# Altium schematic sheet ESP32-HWE.SchDoc
size A4; SheetNumber: 1; SheetTotal: 1
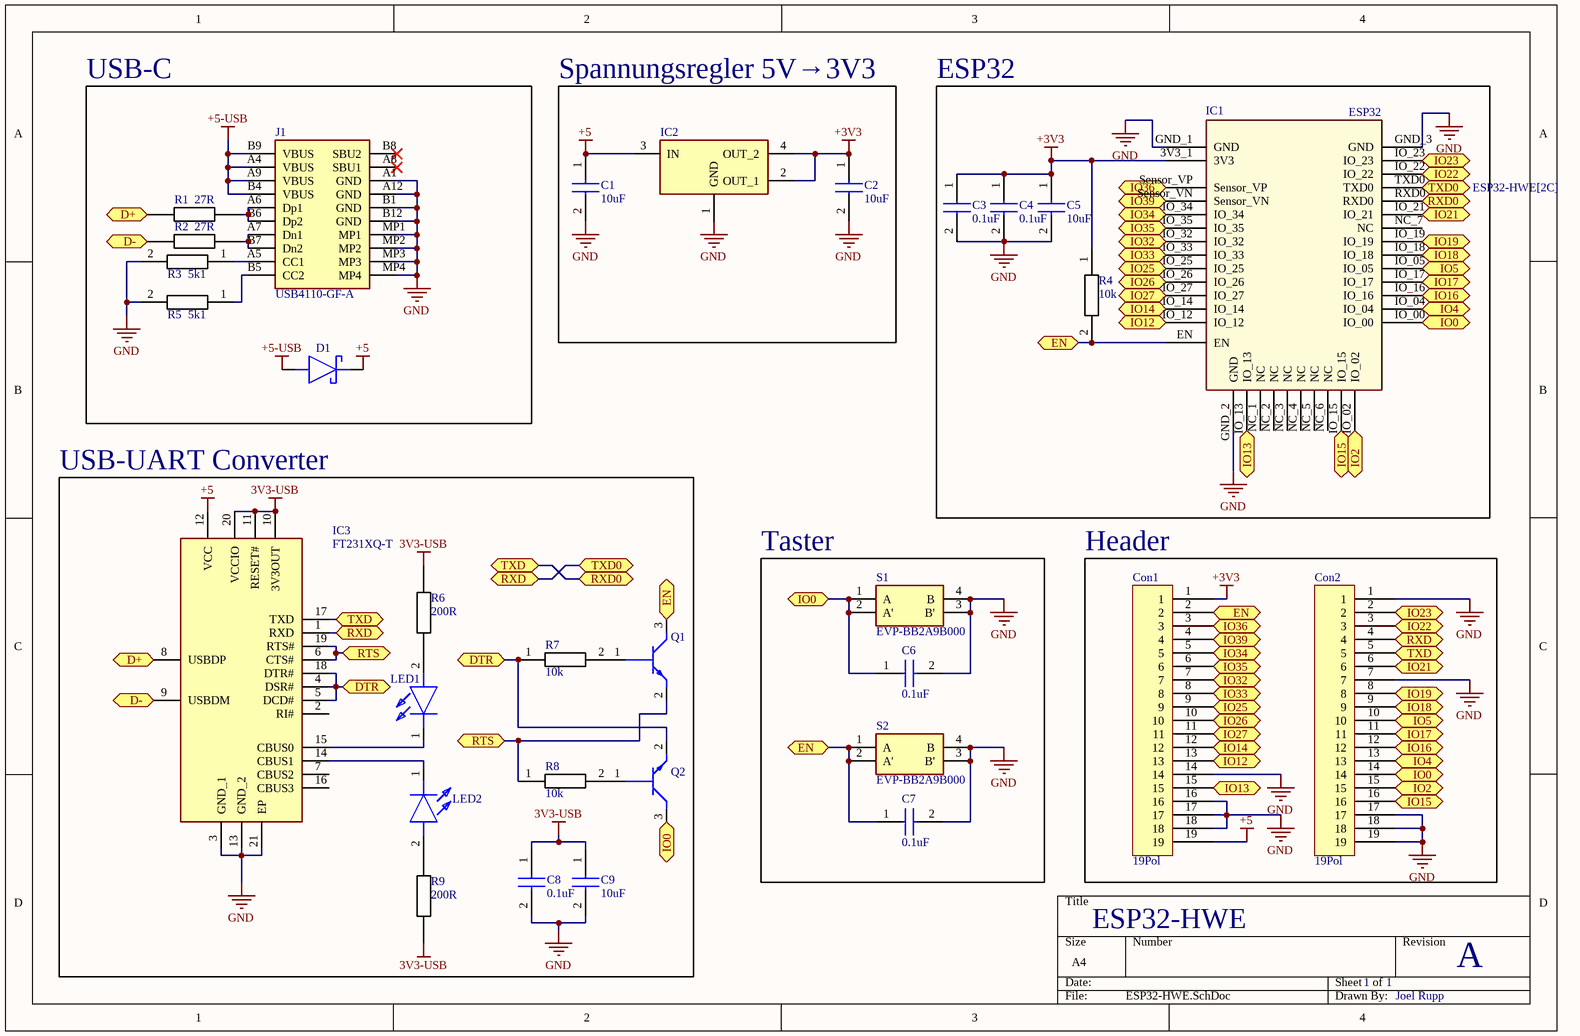
[diagram p0: ESP32-HWE.SchDoc]

## Parts
C1  10uF  [CAPC2012X140N]
C2  10uF  [CAPC2012X140N]
C3  0.1uF  [CAPC2012X94N]
C4  0.1uF  [CAPC2012X94N]
C5  10uF  [CAPC2012X140N]
C6  0.1uF  [CAPC2012X94N]
C7  0.1uF  [CAPC2012X94N]
C8  0.1uF  [CAPC2012X94N]
C9  10uF  [CAPC2012X140N]
Con1  19Pol  [Header_19-Double]  (no BOM)
Con2  19Pol  [Header_19-Double]  (no BOM)
D1  SS0540_R1_00001  [SOD3816X135N]  (value not drawn)
IC1  ESP32  [ESP-WRC]
IC2  AP7361C-33ER-13  [SOT230P700X180-4N]  (value not drawn)
IC3  FT231XQ-T  [QFN50P400X400X80-21N]
J1  USB4110-GF-A  [USB4110GFA]
LED1  150080YS75000  [LEDC2012X80N]  (value not drawn)
LED2  150080YS75000  [LEDC2012X80N]  (value not drawn)
Q1  PMBT3904,235  [SOT95P230X110-3N]  (value not drawn)
Q2  PMBT3904,235  [SOT95P230X110-3N]  (value not drawn)
R1  27R  [RESC2012X65N]
R2  27R  [RESC2012X65N]
R3  5k1  [RESC2012X60N]
R4  10k  [RESC2012X60N]
R5  5k1  [RESC2012X60N]
R6  200R  [RESC2012X50N]
R7  10k  [RESC2012X60N]
R8  10k  [RESC2012X60N]
R9  200R  [RESC2012X50N]
S1  EVP-BB2A9B000  [EVPBB2A9B000]
S2  EVP-BB2A9B000  [EVPBB2A9B000]

## Blocks framed on the sheet
USB-C: D1 J1 R1-R3 R5
Spannungsregler 5V→3V3: C1 C2 IC2
ESP32: C3-C5 IC1 R4
USB-UART Converter: C8 C9 IC3 LED1 LED2 Q1 Q2 R6-R9
Taster: C6 C7 S1 S2
Header: Con1 Con2

## Ports
D+ (bidir, see ESP32-HWE[1A]), D+ (bidir, see ESP32-HWE[1C]), D- (bidir, see ESP32-HWE[1A]), D- (bidir, see ESP32-HWE[1C]), DTR (bidir, see ESP32-HWE[1C]), DTR (bidir, see ESP32-HWE[2C]), EN (bidir, see ESP32-HWE[2C], ESP32-HWE[3B], ESP32-HWE[3C]), EN (bidir, see ESP32-HWE[2C], ESP32-HWE[3B], ESP32-HWE[4C]), EN (bidir, see ESP32-HWE[2C], ESP32-HWE[3C], ESP32-HWE[4C]), EN (bidir, see ESP32-HWE[3B], ESP32-HWE[3C], ESP32-HWE[4C]), IO0 (bidir, see ESP32-HWE[2D], ESP32-HWE[3C], ESP32-HWE[4B]), IO0 (bidir, see ESP32-HWE[2D], ESP32-HWE[3C], ESP32-HWE[4D]), IO0 (bidir, see ESP32-HWE[2D], ESP32-HWE[4B], ESP32-HWE[4D]), IO0 (bidir, see ESP32-HWE[3C], ESP32-HWE[4B], ESP32-HWE[4D]), IO2 (bidir, see ESP32-HWE[4B]), IO2 (bidir, see ESP32-HWE[4D]), IO4 (bidir, see ESP32-HWE[4B]), IO4 (bidir, see ESP32-HWE[4C]), IO5 (bidir, see ESP32-HWE[4B]), IO5 (bidir, see ESP32-HWE[4C]), IO12 (bidir, see ESP32-HWE[3B]), IO12 (bidir, see ESP32-HWE[4C]), IO13 (bidir, see ESP32-HWE[4B]), IO13 (bidir, see ESP32-HWE[4D]), IO14 (bidir, see ESP32-HWE[3B]), IO14 (bidir, see ESP32-HWE[4C]), IO15 (bidir, see ESP32-HWE[4B]), IO15 (bidir, see ESP32-HWE[4D]), IO16 (bidir, see ESP32-HWE[4B]), IO16 (bidir, see ESP32-HWE[4C]), IO17 (bidir, see ESP32-HWE[4B]), IO17 (bidir, see ESP32-HWE[4C]), IO18 (bidir, see ESP32-HWE[4A]), IO18 (bidir, see ESP32-HWE[4C]), IO19 (bidir, see ESP32-HWE[4A]), IO19 (bidir, see ESP32-HWE[4C]), IO21 (bidir, see ESP32-HWE[4A]), IO21 (bidir, see ESP32-HWE[4C]), IO22 (bidir, see ESP32-HWE[4A]), IO22 (bidir, see ESP32-HWE[4C]), IO23 (bidir, see ESP32-HWE[4A]), IO23 (bidir, see ESP32-HWE[4C]), IO25 (bidir, see ESP32-HWE[3B]), IO25 (bidir, see ESP32-HWE[4C]), IO26 (bidir, see ESP32-HWE[3B]), IO26 (bidir, see ESP32-HWE[4C]), IO27 (bidir, see ESP32-HWE[3B]), IO27 (bidir, see ESP32-HWE[4C]), IO32 (bidir, see ESP32-HWE[3A]), IO32 (bidir, see ESP32-HWE[4C]), IO33 (bidir, see ESP32-HWE[3A]), IO33 (bidir, see ESP32-HWE[4C]), IO34 (bidir, see ESP32-HWE[3A]), IO34 (bidir, see ESP32-HWE[4C]), IO35 (bidir, see ESP32-HWE[3A]), IO35 (bidir, see ESP32-HWE[4C]), IO36 (bidir, see ESP32-HWE[3A]), IO36 (bidir, see ESP32-HWE[4C]), IO39 (bidir, see ESP32-HWE[3A]), IO39 (bidir, see ESP32-HWE[4C]), RTS (bidir, see ESP32-HWE[1C]), RTS (bidir, see ESP32-HWE[2C]), RXD0 (bidir, see ESP32-HWE[2C]), RXD0 (bidir, see ESP32-HWE[4A]), RXD (bidir, see ESP32-HWE[1C], ESP32-HWE[2C]), RXD (bidir, see ESP32-HWE[1C], ESP32-HWE[4C]), RXD (bidir, see ESP32-HWE[2C], ESP32-HWE[4C]), TXD0 (bidir, see ESP32-HWE[2C]), TXD0 (bidir, see ESP32-HWE[4A]), TXD (bidir, see ESP32-HWE[1C], ESP32-HWE[2C]), TXD (bidir, see ESP32-HWE[1C], ESP32-HWE[4C]), TXD (bidir, see ESP32-HWE[2C], ESP32-HWE[4C])

## Nets
3V3-USB: C8.1 C9.1 IC3.10(3V3OUT) IC3.11(RESET#) IC3.20(VCCIO) R6.2 R9.1
+3V3: C2.1 C3.1 C4.1 C5.1 Con1.1 IC1.3V3_1(3V3) IC2.2(OUT_1) IC2.4(OUT_2) R4.1
+5: C1.1 Con1.19 D1.1(K) IC2.3(IN) IC3.12(VCC)
+5-USB: D1.2(A) J1.A4(VBUS) J1.A9(VBUS) J1.B4(VBUS) J1.B9(VBUS)
GND: C1.2 C2.2 C3.2 C4.2 C5.2 C6.2 C7.2 C8.2 C9.2 Con1.14 Con1.16 Con1.17 Con1.18 Con2.1 Con2.7 Con2.17 Con2.18 Con2.19 IC1.GND_1(GND) IC1.GND_2(GND) IC1.GND_3(GND) IC2.1(GND) IC3.3(GND_1) IC3.13(GND_2) IC3.21(EP) J1.A1(GND) J1.A12(GND) J1.B1(GND) J1.B12(GND) J1.MP1 J1.MP2 J1.MP3 J1.MP4 R3.2 R5.2 S1.3(B') S1.4(B) S2.3(B') S2.4(B)
D+: IC3.8(USBDP) R1.1 ; port D+
D-: IC3.9(USBDM) R2.1 ; port D-
DTR: IC3.4(DSR#) IC3.5(DCD#) IC3.18(DTR#) Q2.2(E) R7.1 ; port DTR
EN: C7.1 Con1.2 IC1.EN Q1.3(C) R4.2 S2.1(A) S2.2(A') ; port EN
IO0: C6.1 Con2.14 IC1.IO_00 Q2.3(C) S1.1(A) S1.2(A') ; port IO0
IO2: Con2.15 IC1.IO_02 ; port IO2
IO4: Con2.13 IC1.IO_04 ; port IO4
IO5: Con2.10 IC1.IO_05 ; port IO5
IO12: Con1.13 IC1.IO_12 ; port IO12
IO13: Con1.15 IC1.IO_13 ; port IO13
IO14: Con1.12 IC1.IO_14 ; port IO14
IO15: Con2.16 IC1.IO_15 ; port IO15
IO16: Con2.12 IC1.IO_16 ; port IO16
IO17: Con2.11 IC1.IO_17 ; port IO17
IO18: Con2.9 IC1.IO_18 ; port IO18
IO19: Con2.8 IC1.IO_19 ; port IO19
IO21: Con2.6 IC1.IO_21 ; port IO21
IO22: Con2.3 IC1.IO_22 ; port IO22
IO23: Con2.2 IC1.IO_23 ; port IO23
IO25: Con1.9 IC1.IO_25 ; port IO25
IO26: Con1.10 IC1.IO_26 ; port IO26
IO27: Con1.11 IC1.IO_27 ; port IO27
IO32: Con1.7 IC1.IO_32 ; port IO32
IO33: Con1.8 IC1.IO_33 ; port IO33
IO34: Con1.5 IC1.IO_34 ; port IO34
IO35: Con1.6 IC1.IO_35 ; port IO35
IO36: Con1.3 IC1.Sensor_VP ; port IO36
IO39: Con1.4 IC1.Sensor_VN ; port IO39
RTS: IC3.6(CTS#) IC3.19(RTS#) Q1.2(E) R8.1 ; port RTS
RXD: Con2.4 IC1.TXD0 IC3.1(RXD) ; port RXD, port TXD0
RXD0: Con2.5 IC1.RXD0 IC3.17(TXD) ; port TXD, port RXD0
NetIC3_14: IC3.14(CBUS1) LED2.1(K)
NetIC3_15: IC3.15(CBUS0) LED1.1(K)
NetJ1_A5: J1.A5(CC1) R3.1
NetJ1_A6: J1.A6(Dp1) J1.B6(Dp2) R1.2
NetJ1_A7: J1.A7(Dn1) J1.B7(Dn2) R2.2
NetJ1_B5: J1.B5(CC2) R5.1
NetLED1_2: LED1.2(A) R6.1
NetLED2_2: LED2.2(A) R9.2
NetQ1_1: Q1.1(B) R7.2
NetQ2_1: Q2.1(B) R8.2

Not connected (* = marked no-connect by the designer): IC1 NC_1(NC) NC_2(NC) NC_3(NC) NC_4(NC) NC_5(NC) NC_6(NC) NC_7(NC); IC3 2(RI#) 7(CBUS2) 16(CBUS3); J1 A8(SBU1)* B8(SBU2)*

## Notes on the sheet
- ESP32-HWE
- 1
- A
- Joel Rupp

## Library data of the parts
C1 C2 C5 C9 = CL21A106KOQNNNG: Capacitor; Manufacturer_Name: Samsung Electro-Mechanics; Datasheet Link: http://uk.rs-online.com/web/p/products/7665639; Height: 1.4mm; Manufacturer_Part_Number: CL21A106KOQNNNG; Mouser Part Number: 187-CL21A106KOQNNNG; Mouser Price/Stock: https://www.mouser.co.uk/ProductDetail/Samsung-Electro-Mechanics/CL21A106KOQNNNG?qs=hqM3L16%252BxlcMWI7QbqH0LA%3D%3D; Arrow Part Number: CL21A106KOQNNNG; Arrow Price/Stock: https://www.arrow.com/en/products/cl21a106koqnnng/samsung-electro-mechanics?region=nac
C3 C4 C6-C8 = 08055C104KAT2A: Capacitor; Manufacturer_Name: AVX; Datasheet Link: http://datasheets.avx.com/X7RDielectric.pdf; Height: 0.94mm; Manufacturer_Part_Number: 08055C104KAT2A; Mouser Part Number: 581-08055C104K; Mouser Price/Stock: https://www.mouser.co.uk/ProductDetail/AVX/08055C104KAT2A?qs=2ujN4bDBNE9mJvapP%252BjopA%3D%3D; Arrow Part Number: 08055C104KAT2A; Arrow Price/Stock: https://www.arrow.com/en/products/08055c104kat2a/avx
Con1 Con2 = Header_19_Double
D1 = SS0540_R1_00001: Schottky Diode; Manufacturer_Name: PANJIT; Datasheet Link: https://www.panjit.com.tw/upload/datasheet/SS0520_SERIES.pdf; Height: 1.35mm; Manufacturer_Part_Number: SS0540_R1_00001; Mouser Part Number: 241-SS0540_R1_00001; Mouser Price/Stock: https://www.mouser.co.uk/ProductDetail/Panjit/SS0540_R1_00001?qs=sPbYRqrBIVn%2F%252BqoXj%2F1rpw%3D%3D
IC1 = ESP32-WROOM-32E-N16: Manufacturer: Espressif Systems; Supplier 1: Digi-Key; Manufacturer Part Number: ESP32-WROOM-32E-N16; RoHS: No; Category: Uncategorized; Stock 1: 11805; Pricing 1: 1=3,60000 (USD)
IC2 = AP7361C-33ER-13: Integrated Circuit; Manufacturer_Name: Diodes Inc.; Datasheet Link: https://componentsearchengine.com/Datasheets/1/AP7361C-33ER-13.pdf; Height: 1.8mm; Manufacturer_Part_Number: AP7361C-33ER-13; Mouser Part Number: 621-AP7361C-33ER-13; Mouser Price/Stock: https://www.mouser.co.uk/ProductDetail/Diodes-Incorporated/AP7361C-33ER-13?qs=60RJRzIpcl8A1pMqYmc7oA%3D%3D; Arrow Part Number: AP7361C-33ER-13; Arrow Price/Stock: https://www.arrow.com/en/products/ap7361c-33er-13/diodes-incorporated
IC3 = FT231XQ-T: Integrated Circuit; Manufacturer_Name: FTDI Chip; Datasheet Link: http://www.ftdichip.com/Support/Documents/DataSheets/ICs/DS_FT231X.pdf; Height: 0.8mm; Manufacturer_Part_Number: FT231XQ-T; Mouser Part Number: 895-FT231XQ-T; Mouser Price/Stock: https://www.mouser.co.uk/ProductDetail/FTDI/FT231XQ-T?qs=Gp1Yz1mis3WBwU6V7%2FJOkg%3D%3D; Arrow Part Number: FT231XQ-T; Arrow Price/Stock: https://www.arrow.com/en/products/ft231xq-t/ftdi-chip?region=nac
J1 = USB4110-GF-A: Connector; Manufacturer_Name: GCT (GLOBAL CONNECTOR TECHNOLOGY); Datasheet Link: https://gct.co/files/drawings/usb4110.pdf; Height: 3.26mm; Manufacturer_Part_Number: USB4110-GF-A; Mouser Part Number: 640-USB4110-GF-A; Mouser Price/Stock: https://www.mouser.co.uk/ProductDetail/GCT/USB4110-GF-A?qs=KUoIvG%2F9IlYiZvIXQjyJeA%3D%3D
LED1 LED2 = 150080YS75000: LED; Manufacturer_Name: Wurth Elektronik; Datasheet Link: https://katalog.we-online.de/led/datasheet/150080YS75000.pdf; Height: 0.8mm; Manufacturer_Part_Number: 150080YS75000; Mouser Part Number: 710-150080YS75000; Mouser Price/Stock: https://www.mouser.co.uk/ProductDetail/Wurth-Elektronik/150080YS75000?qs=LlUlMxKIyB3k0fZGrDMI2w%3D%3D
Q1 Q2 = PMBT3904,235: Transistor BJT NPN; Manufacturer_Name: Nexperia; Datasheet Link: https://assets.nexperia.com/documents/data-sheet/PMBT3904.pdf; Height: 1.1mm; Manufacturer_Part_Number: PMBT3904,235; Mouser Part Number: 771-PMBT3904235; Mouser Price/Stock: https://www.mouser.co.uk/ProductDetail/Nexperia/PMBT3904235?qs=LOCUfHb8d9uziIfl4fmvZg%3D%3D; Arrow Part Number: PMBT3904,235; Arrow Price/Stock: https://www.arrow.com/en/products/pmbt3904235/nexperia?region=nac
R1 R2 = SFR10EZPF27R0: Resistor; Manufacturer_Name: ROHM Semiconductor; Description: Thick Film Resistors - SMD; Datasheet Link: https://fscdn.rohm.com/en/products/databook/datasheet/passive/resistor/chip_resistor/sfr-e.pdf; Height: 0.65mm; Manufacturer_Part_Number: SFR10EZPF27R0; Mouser Part Number: 755-SFR10EZPF27R0; Mouser Price/Stock: https://www.mouser.co.uk/ProductDetail/ROHM-Semiconductor/SFR10EZPF27R0?qs=Y0Uzf4wQF3lFQtDGyGx0xw%3D%3D
R3 R5 = CR0805-JW-512ELF: Resistor; Manufacturer_Name: Bourns; Datasheet Link: https://www.bourns.com/pdfs/chpreztr.pdf; Height: 0.6mm; Manufacturer_Part_Number: CR0805-JW-512ELF; Mouser Part Number: 652-CR0805JW-512ELF
R4 R7 R8 = RC0805FR-1010KL: Resistor; Manufacturer_Name: KEMET; Datasheet Link: https://datasheet.datasheetarchive.com/originals/distributors/Datasheets_SAMA/902f9e387b938f871d31120f5fc1d65e.pdf; Height: 0.6mm; Manufacturer_Part_Number: RC0805FR-1010KL; Mouser Part Number: 603-RC0805FR-1010KL; Mouser Price/Stock: https://www.mouser.co.uk/ProductDetail/YAGEO/RC0805FR-1010KL?qs=g6xwsc4j%252B%2Fp3VghNFTJwLg%3D%3D; Arrow Part Number: RC0805FR-1010KL; Arrow Price/Stock: https://www.arrow.com/en/products/rc0805fr-1010kl/yageo
R6 R9 = CRCW0805200RJNEA: Resistor; Manufacturer_Name: Vishay; Datasheet Link: http://www.vishay.com/docs/20035/dcrcwe3.pdf; Height: 0.5mm; Manufacturer_Part_Number: CRCW0805200RJNEA; Mouser Part Number: 71-CRCW0805200RJNEA; Mouser Price/Stock: https://www.mouser.co.uk/ProductDetail/Vishay-Dale/CRCW0805200RJNEA?qs=t6Mf8e9K%2FulaYQcj5GyGqg%3D%3D; Arrow Part Number: CRCW0805200RJNEA; Arrow Price/Stock: https://www.arrow.com/en/products/crcw0805200rjnea/vishay
S1 S2 = EVP-BB2A9B000: Switch; Manufacturer_Name: Panasonic; Datasheet Link: https://industrial.panasonic.com/ac/cdn/e/control/switch/light-touch/catalog/sw_lt_eng_2616s.pdf; Height: 0mm; Manufacturer_Part_Number: EVP-BB2A9B000; Mouser Part Number: 667-EVP-BB2A9B000; Mouser Price/Stock: https://www.mouser.co.uk/ProductDetail/Panasonic/EVP-BB2A9B000?qs=iHX4uCgIbgPa3HqgzZ6vLw%3D%3D; Arrow Part Number: EVP-BB2A9B000; Arrow Price/Stock: https://www.arrow.com/en/products/evp-bb2a9b000/panasonic?region=nac